# EAGLE design 215_rtc (EAGLE 9.6.2)
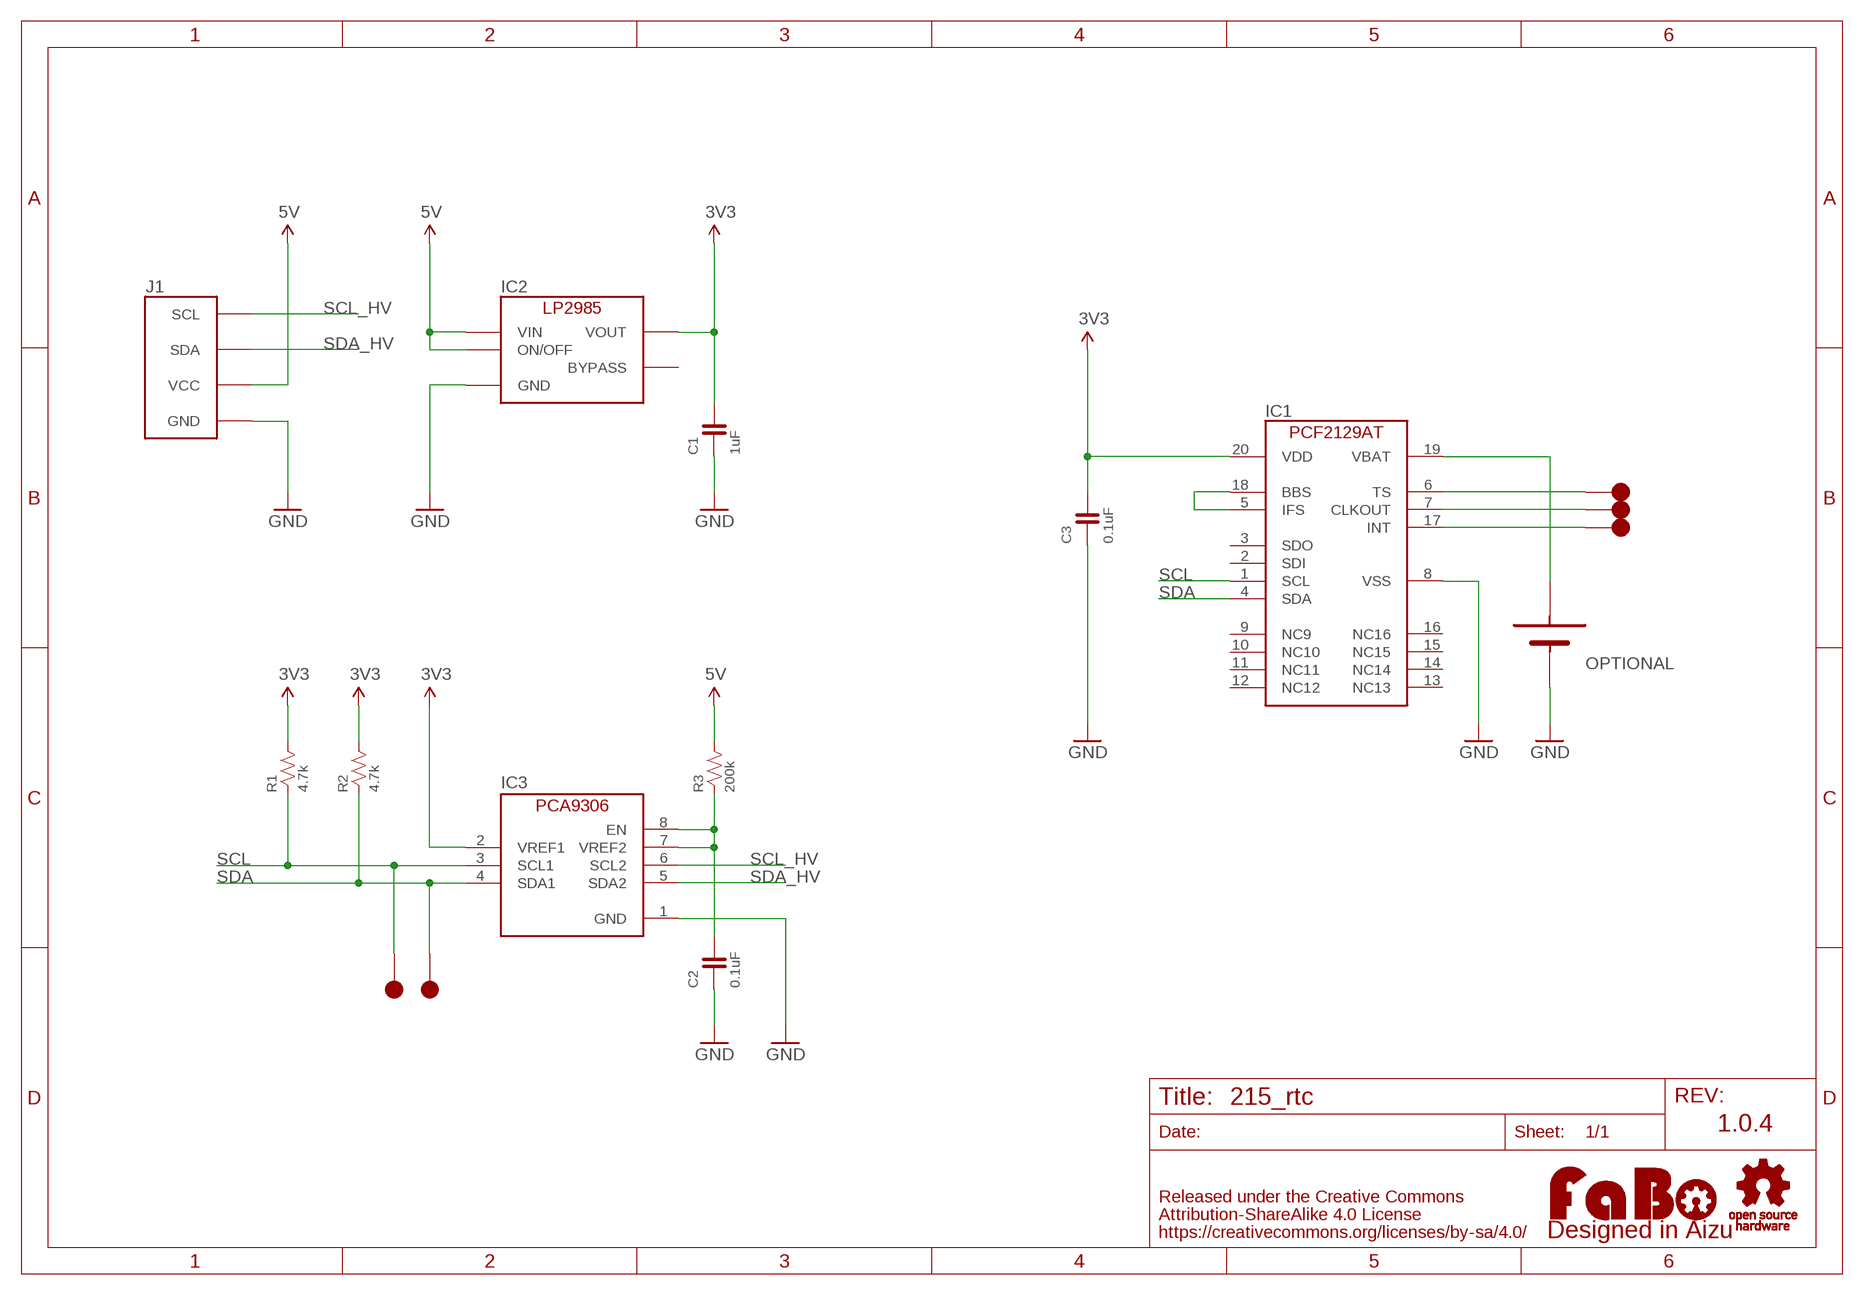
[diagram p0: schematic, sheet 1]

## Parts
C1  1uF  CAPACITOR-0603  [0603]
C2  0.1uF  CAPACITOR-0603  [0603]
C3  0.1uF  CAPACITOR-0603  [0603]
IC1  RTC-PCF2129AT  [SO20]
IC2  LP2985-33DBV  [SOT-23-5]
IC3  PCA9306GM  [XQFN8]
J1  FABO_BRICK_I2C  [FABO_BRICK_I2C]
LOGO1  LOGO_FABO-M  [LOGO_FABO_M]
R1  4.7k  RESISTOR-0603  [0603]
R2  4.7k  RESISTOR-0603  [0603]
R3  200k  RESISTOR-0603  [0603]
TP1  TP-15  [TP-15]
TP2  TP-15  [TP-15]
TP3  TP-15  [TP-15]
TP4  TP-15  [TP-15]
TP5  TP-15  [TP-15]
U$2  LOGO_OSHW-M_BOTTOM  [LOGO_OSHW_M_BOTTOM]
U$4  BATTERY-SMTU2450  [TAKACHI-SMTU2450]

## Nets
3V3: C1.2 C3.2 IC1.20(VDD) IC2.5(VOUT) IC3.2(VREF1) R1.2 R2.2
5V: IC2.1(VIN) IC2.3(ON/OFF) J1.VCC R3.2
GND: C1.1 C2.1 C3.1 IC1.8(VSS) IC2.2(GND) IC3.1(GND) J1.GND U$4.2(-)
N$1: IC1.19(VBAT) U$4.1(+)
N$2: C2.2 IC3.7(VREF2) IC3.8(EN) R3.1
N$3: IC1.5(IFS) IC1.18(BBS)
N$4: IC1.6(TS) TP3.1
N$5: IC1.7(CLKOUT) TP4.1
N$6: IC1.17(INT) TP5.1
SCL: IC1.1(SCL) IC3.3(SCL1) R1.1 TP2.1
SCL_HV: IC3.6(SCL2) J1.SCL
SDA: IC1.4(SDA) IC3.4(SDA1) R2.1 TP1.1
SDA_HV: IC3.5(SDA2) J1.SDA
Unconnected: IC1.2(SDI) IC1.3(SDO) IC1.9(NC9) IC1.10(NC10) IC1.11(NC11) IC1.12(NC12) IC1.13(NC13) IC1.14(NC14) IC1.15(NC15) IC1.16(NC16) IC2.4(BYPASS)

## Notes on the sheet
- OPTIONAL
- 1.0.4

## Library data of the parts
C1-C3 = FaBo-Capacitor:CAPACITOR: CAPACITOR
IC1 = FaBo-etc:RTC-PCF2129AT
IC2 = FaBo-Supply:LP2985: LP2985
IC3 = FaBo-LevelTranslator:PCA9306
J1 = FaBo-Template:FABO_BRICK_I2C: FaBo Brick I2C
LOGO1 = component:LOGO_FABO
R1-R3 = FaBo-Resistors:RESISTOR: RESISTOR
TP1-TP5 = FaBo-Supply:TP
U$2 = FaBo-etc:LOGO_OSHW
U$4 = FaBo-Parts:BATTERY

## Board
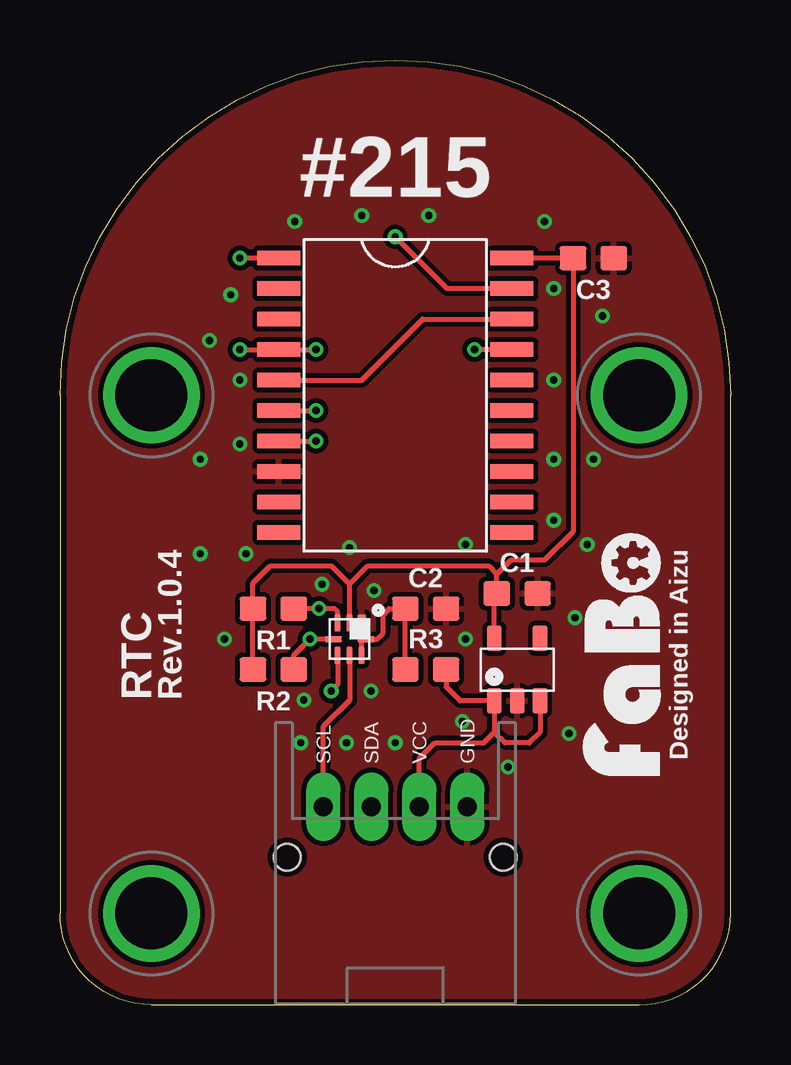
[diagram p1: board, top side]
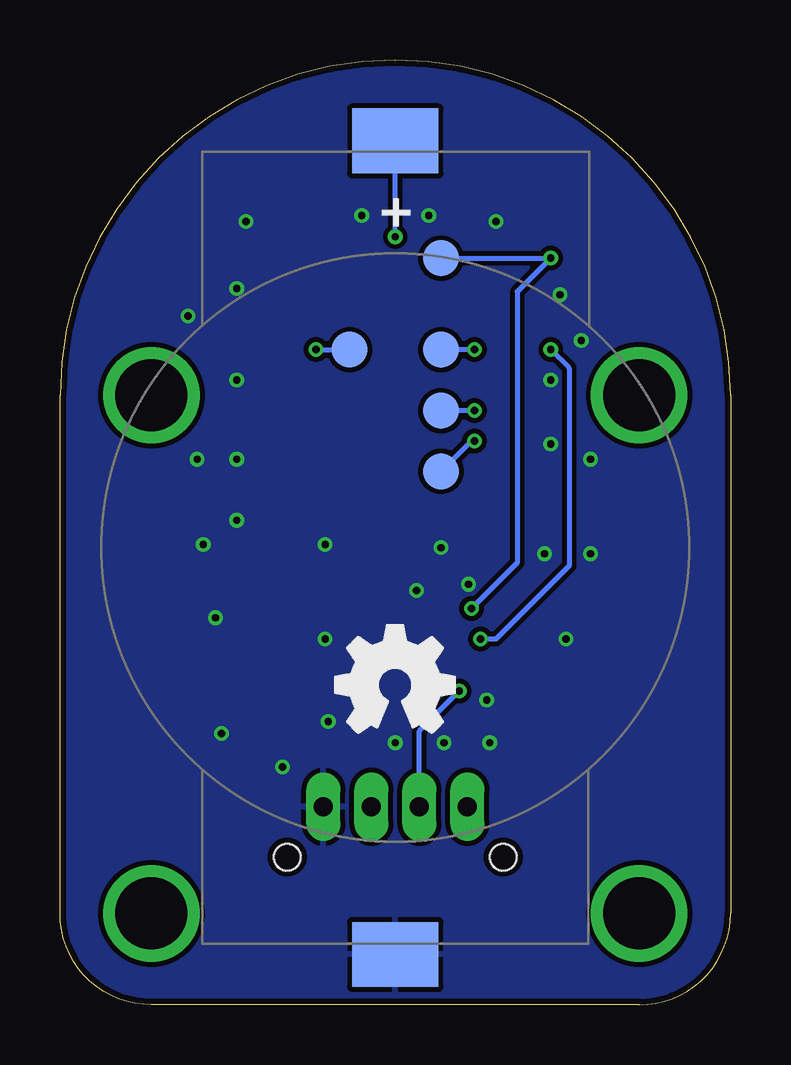
[diagram p2: board, bottom side, seen from below]

Size 27.94 x 39.37 mm. Coordinates in mm from the lower left corner, seen from the top.
Copper layers (1*16): Top 0.035mm / dielectric 1.6mm / Bottom 0.035mm
Design rules "PCBway": minimum track width 6mil, minimum drill 12mil, track to track 6mil, track to pad 6mil, pad to pad 6mil, via to via 6mil, smd to smd 6mil, copper to edge 10mil, drill to drill 10mil, minimum pad ring 10mil, minimum via ring 6mil, stop-mask expansion 2mil, vias tented up to drill 100mil, thermal gap 8mil

### Footprints (pad centres in the part's own frame; a part is rotated, then mirrored left to right if it is on the bottom)
0603 = smd 1.1 x 1: 1 -0.85,0; 2 0.85,0
SO20 = smd 1.8 x 0.6: 1 -4.85,5.715; 2 -4.85,4.445; 3 -4.85,3.175; 4 -4.85,1.905; 5 -4.85,0.635; 6 -4.85,-0.635; 7 -4.85,-1.905; 8 -4.85,-3.175; 9 -4.85,-4.445; 10 -4.85,-5.715; 11 4.85,-5.715; 12 4.85,-4.445; 13 4.85,-3.175; 14 4.85,-1.905; 15 4.85,-0.635; 16 4.85,0.635; 17 4.85,1.905; 18 4.85,3.175; 19 4.85,4.445; 20 4.85,5.715
SOT-23-5 = smd 0.6 x 1.05: 1 -0.95,-1.3; 2 0,-1.3; 3 0.95,-1.3; 4 0.95,1.3; 5 -0.95,1.3
XQFN8 = smd 0.7 x 0.35: 1 -0.675,0.5 | smd 0.7 x 0.25: 2 -0.675,0; 3 -0.675,-0.5; 5 0.675,-0.5; 6 0.675,0; 7 0.675,0.5 | smd 0.25 x 0.7: 4 0,-0.675; 8 0,0.675
FABO_BRICK_I2C = drill 0.8 pad 1.422 long: GND 3,-10.795; SCL -3,-10.795; SDA -1,-10.795; VCC 1,-10.795 | drill 3 pad 3.81: P$1 -10.16,6.35; P$2 10.16,6.35; P$3 -10.16,-15.24; P$4 10.16,-15.24 | hole 1.1: -4.5,-12.895; 4.5,-12.895
TP-15 = smd 1.5 x 1.5: 1 0,0
TAKACHI-SMTU2450 = smd 2.7 x 3.6: 1 -16.95,0; 2 16.95,0

### Placement (x,y rotation side)
C1  19.05,17.14 180 top
C2  15.24,16.51 180 top
C3  22.23,31.11 180 top
IC1  13.97,25.4 0 top
IC2  19.05,13.97 0 top
IC3  12.06,15.24 270 top
J1  13.97,19.05 0 top
LOGO1  25.4,14.61 90 top
R1  8.89,16.51 180 top
R2  8.89,13.97 180 top
R3  15.24,13.97 0 top
TP1  12.06,27.3 0 bottom
TP2  12.06,31.11 0 bottom
TP3  12.06,24.77 0 bottom
TP4  12.06,22.23 0 bottom
TP5  15.88,27.3 0 bottom
U$2  13.97,13.34 0 top
U$4  13.97,19.05 270 bottom

### Tracks (layer width: path | path; a pad name or v marks a point on that pad's centre or on a via)
3V3
  Top 0.203: IC2.5 18.1,17.05 C1.2 18.2,17.95 | 18.2,17.95 18.8,18.54 20.19,18.54 21.38,19.72 C3.2 IC1.20 | IC3.2 12.06,17.53 | 12.06,17.53 12.83,18.29 17.86,18.29 18.2,17.95 | R2.2 R1.2 8.04,17.57 8.76,18.29 11.3,18.29 12.06,17.53
5V
  Top 0.203: 18.1,11.36 IC2.1 16.67,12.67 16.09,13.25 R3.2 | 18.1,11.36 18.54,10.92 19.56,10.92 20,11.36 IC2.3 | J1.VCC 14.97,10.27 15.62,10.92 17.66,10.92 18.1,11.36
GND  (via drill 0.3)
  other vias: 7.75,18.8 5.84,18.8 6.22,27.69 7.49,26.04 7.49,23.37 5.84,22.73 7.11,29.59 9.78,32.64 12.57,32.89 15.37,32.89 20.19,32.64 20.57,29.84 22.61,28.7 20.57,26.04 22.23,22.73 20.57,22.73 20.57,20.19 21.97,19.18 21.46,16.13 21.21,11.3 16.76,11.81 18.67,9.91 13.08,17.27 12.95,13.08 11.94,10.92 10.03,10.92 13.97,10.92 16.89,15.24 10.92,17.53 6.86,15.24 10.16,12.7 12.06,19.05 16.89,19.18
  pour Bottom (isolate 0.203): 0,0 27.94,0 27.94,39.37 0,39.37
  pour Top (isolate 0.203): 0,0 27.94,0 27.94,39.37 0,39.37
N$1  (via drill 0.3)
  Top 0.203: IC1.19 16.13,29.84 v13.97,32
  Bottom 0.203: v13.97,32 U$4.1
N$2
  Top 0.203: R3.1 C2.2 13.72,16.51 13.46,16.26 13.46,15.49 13.21,15.24 IC3.8 12.56,15.24 IC3.7
N$3
  Top 0.203: IC1.5 12.57,26.04 15.11,28.57 IC1.18
N$4  (via drill 0.3)
  Top 0.203: IC1.6 v10.67,24.77
  Bottom 0.203: v10.67,24.77 TP3.1
N$5  (via drill 0.3)
  Top 0.203: IC1.7 v10.67,23.5
  Bottom 0.203: v10.67,23.5 10.79,23.5 TP4.1
N$6  (via drill 0.3)
  Top 0.203: IC1.17 v17.27,27.3
  Bottom 0.203: v17.27,27.3 TP5.1
SCL  (via drill 0.3)
  Top 0.203: R1.1 v10.79,16.51 11.43,16.51 11.56,16.38 IC3.3 | IC1.1 v7.49,31.11
  Bottom 0.203: v10.79,16.51 8.89,18.41 8.89,29.72 v7.49,31.11 TP2.1
SCL_HV
  Top 0.203: IC3.6 12.06,12.7 10.97,11.61 J1.SCL
SDA  (via drill 0.3)
  Top 0.203: R2.1 9.74,14.57 v10.41,15.24 IC3.4 | v7.49,27.3 IC1.4 v10.67,27.3
  Bottom 0.203: v7.49,27.3 6.73,26.54 6.73,18.29 9.78,15.24 v10.41,15.24 | v10.67,27.3 TP1.1
SDA_HV  (via drill 0.3)
  Top 0.203: IC3.5 11.56,13.34 v11.3,13.08
  Bottom 0.203: v11.3,13.08 12.97,11.41 J1.SDA

### Text on the board
tPlace: #215 | Designed in Aizu | RTC | Rev.1.0.4
bPlace: +